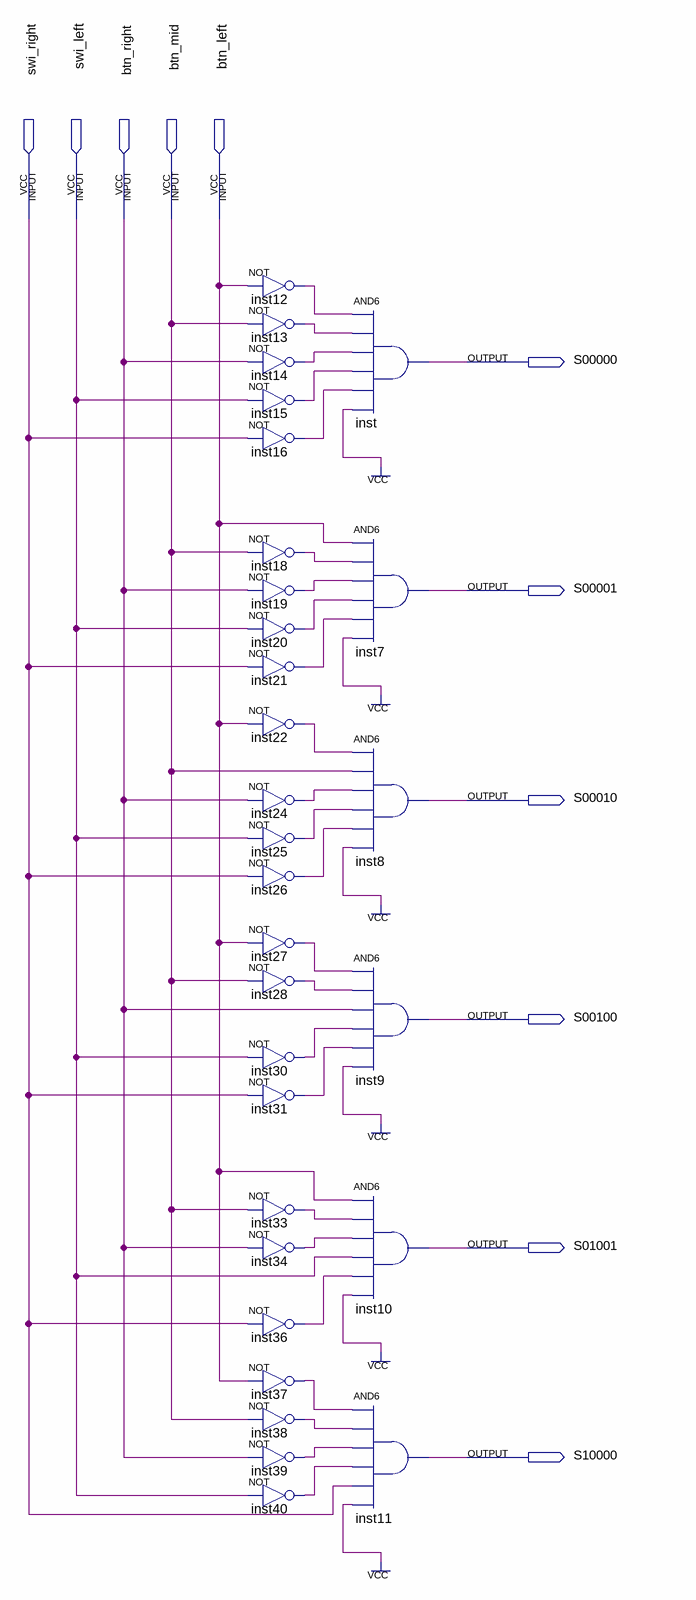
[diagram p0: schematic sheet]
// Quartus schematic decod5x6.bdf as structural Verilog: 30 symbols, 11 pins
module decod5x6 (
  input  swi_right,
  input  swi_left,
  input  btn_right,
  input  btn_mid,
  input  btn_left,
  output S00000,
  output S00001,
  output S00010,
  output S00100,
  output S01001,
  output S10000
);

  wire inst12_out, inst13_out, inst14_out, inst15_out, inst16_out, inst18_out, inst19_out, inst20_out,
       inst21_out, inst22_out, inst24_out, inst25_out, inst26_out, inst27_out, inst28_out, inst30_out,
       inst31_out, inst33_out, inst34_out, inst36_out, inst37_out, inst38_out, inst39_out, inst40_out;

  not inst12 (inst12_out, btn_left);
  not inst13 (inst13_out, btn_mid);
  not inst14 (inst14_out, btn_right);
  not inst15 (inst15_out, swi_left);
  not inst16 (inst16_out, swi_right);
  not inst18 (inst18_out, btn_mid);
  not inst19 (inst19_out, btn_right);
  not inst20 (inst20_out, swi_left);
  not inst21 (inst21_out, swi_right);
  not inst22 (inst22_out, btn_left);
  not inst24 (inst24_out, btn_right);
  not inst25 (inst25_out, swi_left);
  not inst26 (inst26_out, swi_right);
  not inst27 (inst27_out, btn_left);
  not inst28 (inst28_out, btn_mid);
  not inst30 (inst30_out, swi_left);
  not inst31 (inst31_out, swi_right);
  not inst33 (inst33_out, btn_mid);
  not inst34 (inst34_out, btn_right);
  not inst36 (inst36_out, swi_right);
  not inst37 (inst37_out, btn_left);
  not inst38 (inst38_out, btn_mid);
  not inst39 (inst39_out, btn_right);
  not inst40 (inst40_out, swi_left);
  and inst (S00000, inst12_out, inst13_out, inst14_out, inst15_out, inst16_out, 1'b1);
  and inst7 (S00001, btn_left, inst18_out, inst19_out, inst20_out, inst21_out, 1'b1);
  and inst8 (S00010, inst22_out, btn_mid, inst24_out, inst25_out, inst26_out, 1'b1);
  and inst9 (S00100, inst27_out, inst28_out, btn_right, inst30_out, inst31_out, 1'b1);
  and inst10 (S01001, btn_left, inst33_out, inst34_out, swi_left, inst36_out, 1'b1);
  and inst11 (S10000, inst37_out, inst38_out, inst39_out, inst40_out, swi_right, 1'b1);
endmodule
